# EAGLE design obdlogger_v0.2 (EAGLE 8.6.0)
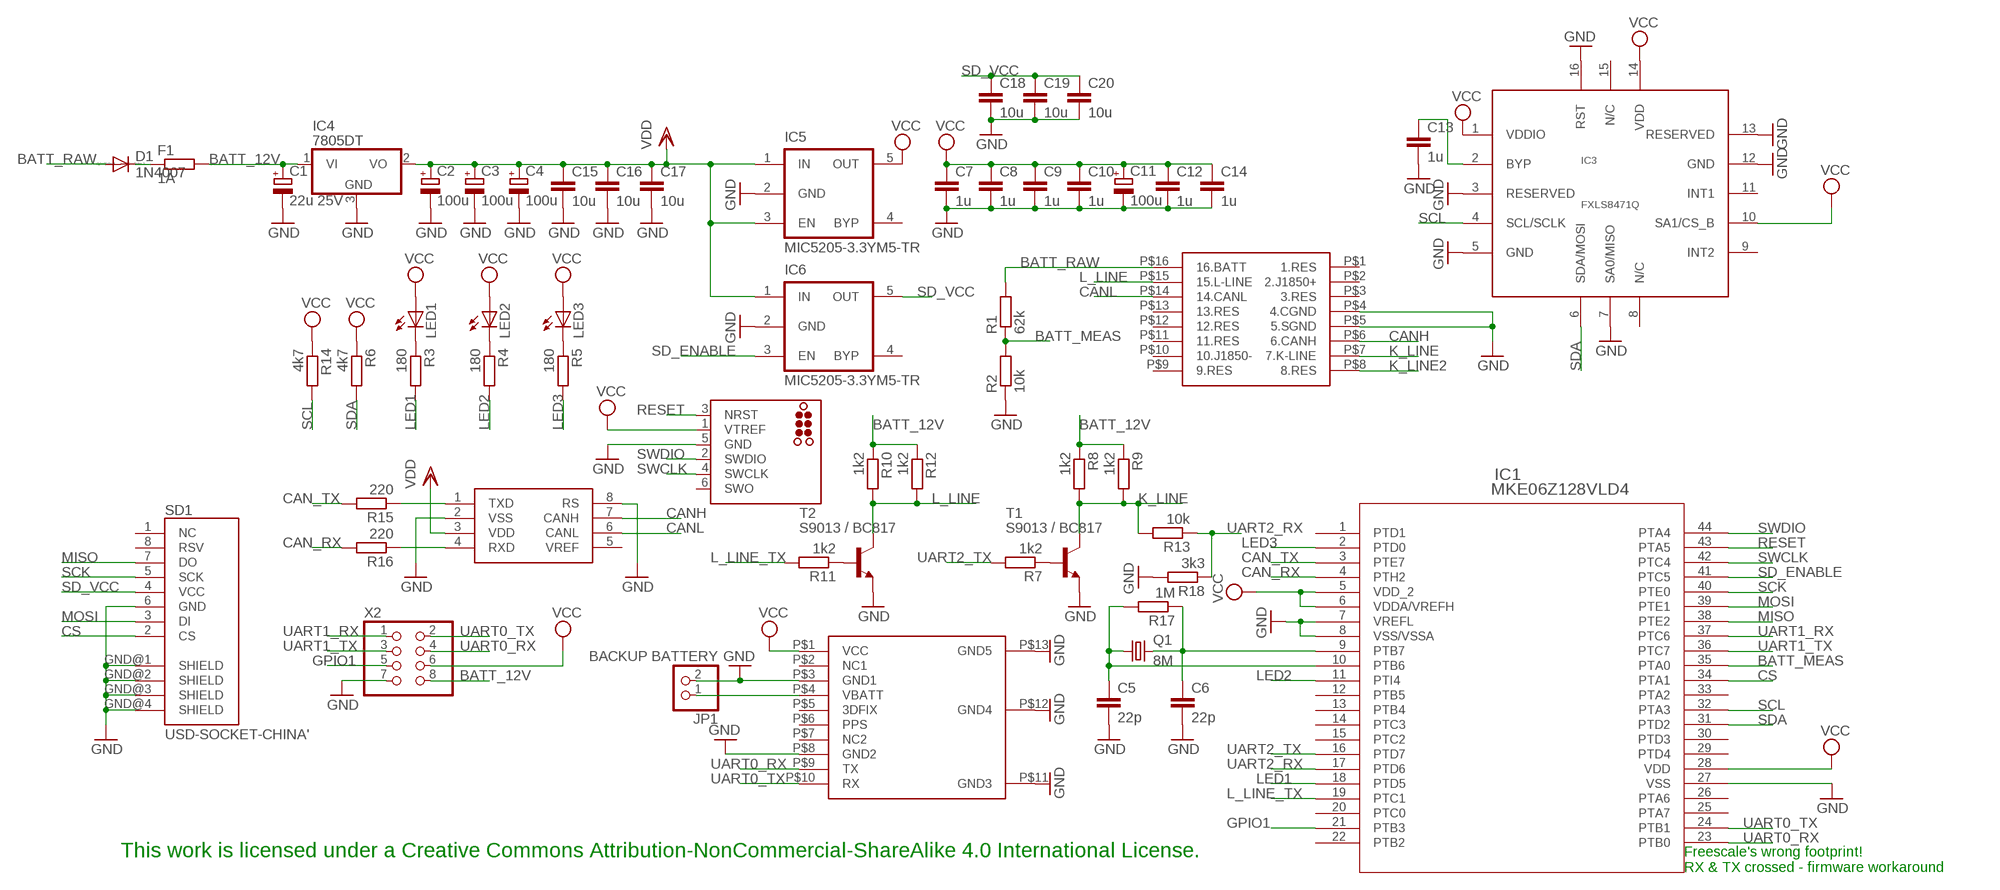
[diagram p0: schematic, sheet 1]

## Parts
C1  22u 25V  CPOL-EUSMCC  [SMC_C]
C2  100u  CPOL-EUSMCB  [SMC_B]
C3  100u  CPOL-EUSMCB  [SMC_B]
C4  100u  CPOL-EUSMCB  [SMC_B]
C5  22p  C-EUC0603K  [C0603K]
C6  22p  C-EUC0603K  [C0603K]
C7  1u  C-EUC0603K  [C0603K]
C8  1u  C-EUC0603K  [C0603K]
C9  1u  C-EUC0603K  [C0603K]
C10  1u  C-EUC0603K  [C0603K]
C11  100u  CPOL-EUSMCB  [SMC_B]
C12  1u  C-EUC0603K  [C0603K]
C13  1u  C-EUC0603K  [C0603K]
C14  1u  C-EUC0603K  [C0603K]
C15  10u  C-EUC0603K  [C0603K]
C16  10u  C-EUC0603K  [C0603K]
C17  10u  C-EUC0603K  [C0603K]
C18  10u  C-EUC0603K  [C0603K]
C19  10u  C-EUC0603K  [C0603K]
C20  10u  C-EUC0603K  [C0603K]
D1  1N4007  DIODE-C1702-05  [C1702-05]
F1  1A  R-EU_R1206  [R1206]
IC1  MKE06Z128VLD4  [LQFP-44_10X10X1.4]
IC2  MCP2561  MCP2551  [SO08]
IC3  FXLS8471Q  [16QFN-5/3]
IC4  7805DT  [TO252]
IC5  MIC5205-3.3YM5-TR  MIC5205  [SOT-23-5]
IC6  MIC5205-3.3YM5-TR  MIC5205  [SOT-23-5]
JP1  BACKUP BATTERY  PINHD-1X2  [1X02]
LED1  LED3MM  [LED3MM]
LED2  LED3MM  [LED3MM]
LED3  LED3MM  [LED3MM]
Q1  8M  CRYSTALHC49UP  [HC49UP]
R1  62k  R-EU_R0603  [R0603]
R2  10k  R-EU_R0603  [R0603]
R3  180  R-EU_R0603  [R0603]
R4  180  R-EU_R0603  [R0603]
R5  180  R-EU_R0603  [R0603]
R6  4k7  R-EU_R0603  [R0603]
R7  1k2  R-EU_R0603  [R0603]
R8  1k2  R-EU_M1206  [M1206]
R9  1k2  R-EU_M1206  [M1206]
R10  1k2  R-EU_M1206  [M1206]
R11  1k2  R-EU_R0603  [R0603]
R12  1k2  R-EU_M1206  [M1206]
R13  10k  R-EU_R0603  [R0603]
R14  4k7  R-EU_R0603  [R0603]
R15  220  R-EU_R0603  [R0603]
R16  220  R-EU_R0603  [R0603]
R17  1M  R-EU_R0603  [R0603]
R18  3k3  R-EU_R0603  [R0603]
SD1  USD-SOCKET-CHINA'  [USD-SOCKET-PP]
T1  S9013 / BC817  BC817-16-NPN-SOT23-BEC  [SOT23-BEC]
T2  S9013 / BC817  BC817-16-NPN-SOT23-BEC  [SOT23-BEC]
U$2  SWD-NEEDLE  [TC2030-MCP]
U$4  PA6C  [PA6C]
X1  OBD2-RIGHT-ANGLEPROPER  [OBD2-RIGHT-ANGLE-PCB-PROPER]
X2  PINHD-2X4  [2X04]

## Nets
BATT_12V: C1.+ F1.2 IC4.1(VI) R8.1 R9.1 R10.1 R12.1 X2.8
BATT_MEAS: IC1.35(PTA0) R1.1 R2.2
BATT_RAW: D1.A R1.2 X1.P$16(16.BATT)
CAN_RX: IC1.4(PTH2) R16.2
CAN_TX: IC1.3(PTE7) R15.2
CANH: IC2.7(CANH) X1.P$6(6.CANH)
CANL: IC2.6(CANL) X1.P$14(14.CANL)
CS: IC1.34(PTA1) SD1.2(CS)
GND: C1.- C2.- C3.- C4.- C5.2 C6.2 C7.2 C8.2 C9.2 C10.2 C11.- C12.2 C13.2 C14.2 C15.2 C16.2 C17.2 C18.2 C19.2 C20.2 IC1.7(VREFL) IC1.8(VSS/VSSA) IC1.27(VSS) IC2.2(VSS) IC2.8(RS) IC3.3(RESERVED) IC3.5(GND) IC3.7(SA0/MISO) IC3.12(GND) IC3.13(RESERVED) IC3.16(RST) IC4.3(GND) IC5.2(GND) IC6.2(GND) JP1.2 R2.1 R18.2 SD1.6(GND) SD1.GND@1(SHIELD) SD1.GND@2(SHIELD) SD1.GND@3(SHIELD) SD1.GND@4(SHIELD) T1.E T2.E U$2.5(GND) U$4.P$3(GND1) U$4.P$8(GND2) U$4.P$11(GND3) U$4.P$12(GND4) U$4.P$13(GND5) X1.P$4(4.CGND) X1.P$5(5.SGND) X2.7
GPIO1: IC1.21(PTB3) X2.5
K_LINE: R8.2 R9.2 R13.2 T1.C X1.P$7(7.K-LINE)
K_LINE2: X1.P$8(8.RES)
L_LINE: R10.2 R12.2 T2.C X1.P$15(15.L-LINE)
L_LINE_TX: IC1.19(PTC1) R11.2
LED1: IC1.18(PTD5) R3.2
LED2: IC1.11(PTI4) R4.2
LED3: IC1.2(PTD0) R5.2
MISO: IC1.38(PTE2) SD1.7(DO)
MOSI: IC1.39(PTE1) SD1.3(DI)
N$1: LED1.K(C) R3.1
N$2: JP1.1 U$4.P$4(VBATT)
N$3: R7.1 T1.B
N$4: LED2.K(C) R4.1
N$5: LED3.K(C) R5.1
N$6: C6.1 IC1.9(PTB7) Q1.2 R17.1
N$7: C5.1 IC1.10(PTB6) Q1.1 R17.2
N$8: C13.1 IC3.2(BYP)
N$9: IC2.1(TXD) R15.1
N$10: IC2.4(RXD) R16.1
N$11: D1.C F1.1
N$12: R11.1 T2.B
RESET: IC1.43(PTA5) U$2.3(NRST)
SCK: IC1.40(PTE0) SD1.5(SCK)
SCL: IC1.32(PTA3) IC3.4(SCL/SCLK) R14.2
SD_ENABLE: IC1.41(PTC5) IC6.3(EN)
SD_VCC: C18.1 C19.1 C20.1 IC6.5(OUT) SD1.4(VCC)
SDA: IC1.31(PTD2) IC3.6(SDA/MOSI) R6.2
SWCLK: IC1.42(PTC4) U$2.4(SWCLK)
SWDIO: IC1.44(PTA4) U$2.2(SWDIO)
UART0_RX: IC1.23(PTB0) U$4.P$9(TX) X2.4
UART0_TX: IC1.24(PTB1) U$4.P$10(RX) X2.2
UART1_RX: IC1.37(PTC6) X2.1
UART1_TX: IC1.36(PTC7) X2.3
UART2_RX: IC1.17(PTD6) R13.1 R18.1
UART2_TX: IC1.16(PTD7) R7.2
VCC: C7.1 C8.1 C9.1 C10.1 C11.+ C12.1 C14.1 IC1.5(VDD_2) IC1.6(VDDA/VREFH) IC1.28(VDD) IC3.1(VDDIO) IC3.10(SA1/CS_B) IC3.14(VDD) IC5.5(OUT) LED1.A LED2.A LED3.A R6.1 R14.1 U$2.1(VTREF) U$4.P$1(VCC) X2.6
VCC_5V: C2.+ C3.+ C4.+ C15.1 C16.1 C17.1 IC2.3(VDD) IC4.2(VO) IC5.1(IN) IC5.3(EN) IC6.1(IN) ; supply symbol labelled VDD
Unconnected: IC1.1(PTD1) IC1.12(PTB5) IC1.13(PTB4) IC1.14(PTC3) IC1.15(PTC2) IC1.20(PTC0) IC1.22(PTB2) IC1.25(PTA7) IC1.26(PTA6) IC1.29(PTD4) IC1.30(PTD3) IC1.33(PTA2) IC2.5(VREF) IC3.8(N/C) IC3.9(INT2) IC3.11(INT1) IC3.15(N/C) IC5.4(BYP) IC6.4(BYP) SD1.1(NC) SD1.8(RSV) U$2.6(SWO) U$4.P$2(NC1) U$4.P$5(3DFIX) U$4.P$6(PPS) U$4.P$7(NC2) X1.P$1(1.RES) X1.P$2(2.J1850+) X1.P$3(3.RES) X1.P$9(9.RES) X1.P$10(10.J1850-) X1.P$11(11.RES) X1.P$12(12.RES) X1.P$13(13.RES)

## Notes on the sheet
- This work is licensed under a Creative Commons Attribution-NonCommercial-ShareAlike 4.0 International License.
- Freescale's wrong footprint!
  RX & TX crossed - firmware workaround

## Library data of the parts
C1-C4 C11 = rcl:CPOL-EU: POLARIZED CAPACITOR, European symbol; SPICEPREFIX: C
C5-C10 C12-C20 = rcl:C-EU: CAPACITOR, European symbol; SPICEPREFIX: C
D1 = diode:DIODE-: DIODE
F1 = resistor:R-EU_: RESISTOR, European symbol
IC1 = obd-connector:MKE06Z128VLD4; CPU: ARM Cortex-M0+; FLASHKB: 128; MANUFACTURER_PART_NUMBER: mke06z128vld4; MAXFREQUENCY: 48; PINCOUNT: 44; SRAMKB: 16; VENDOR: FREESCALE
IC2 = SparkFun:MCP2551
IC3 = BaseApp:FXLS8471Q: Digikey No :- __FXLS8471QR1CT-ND__
IC4 = linear:78*: Positive VOLTAGE REGULATOR Source: http://cache.national.com/ds/LM/LM78L05.pdf http://www.fairchildsemi.com/ds/LM/LM7805.pdf
IC5 IC6 = dp_devices:MIC5205: 150ma Low-Noise LDO Regulator
JP1 = pinhead:PINHD-1X2: PIN HEADER
LED1-LED3 = led:LED: LED OSRAM: - CHIPLED LG R971, LG N971, LY N971, LG Q971, LY Q971, LO R971, LY R971 LH N974, LH R974 LS Q976, LO Q976, LY Q976 LO Q996 - Hyper CHIPLED LW Q18S LB Q993, LB Q99A, LB R99A - SideLED LS A670, LO A670, LY A670, LG A670, LP A670 LB A673, LV A673, LT A673, LW A673 LH A674 LY A675 LS A676, LA A676, LO A676, LY A676, LW A676 LS A679, LY A679, LG A679 - Hyper Micro SIDELED® LS Y876, LA Y876, LO Y876, LY Y876 LT Y87S - SmartLED LW L88C, LW L88S LB L89C, LB L89S, LG L890 LS L89K, LO L89K, LY L89K LS L896, LA L896, LO L896, LY L896 - TOPLED LS T670, LO T670, LY T670, LG T670, LP T670 LSG T670, LSP T670, LSY T670, LOP T670, LYG T670 LG T671, LOG T671, LSG T671 LB T673, LV T673, LT T673, LW T673 LH T674 LS T676, LA T676, LO T676, LY T676, LB T676, LH T676, LSB T676, LW T676 LB T67C, LV T67C, LT T67C, LS T67K, LO T67K, LY T67K, LW E67C LS E67B, LA E67B, LO E67B, LY E67B, LB E67C, LV E67C, LT E67C LW T67C LS T679, LY T679, LG T679 LS T770, LO T770, LY T770, LG T770, LP T770 LB T773, LV T773, LT T773, LW T773 LH T774 LS E675, LA E675, LY E675, LS T675 LS T776, LA T776, LO T776, LY T776, LB T776 LHGB T686 LT T68C, LB T68C - Hyper Mini TOPLED® LB M676 - Mini TOPLED Santana® LG M470 LS M47K, LO M47K, LY M47K Source: http://www.osram.convergy.de LUXEON: - LUMILED® LXK2-PW12-R00, LXK2-PW12-S00, LXK2-PW14-U00, LXK2-PW14-V00 LXK2-PM12-R00, LXK2-PM12-S00, LXK2-PM14-U00 LXK2-PE12-Q00, LXK2-PE12-R00, LXK2-PE12-S00, LXK2-PE14-T00, LXK2-PE14-U00 LXK2-PB12-K00, LXK2-PB12-L00, LXK2-PB12-M00, LXK2-PB14-N00, LXK2-PB14-P00, LXK2-PB14-Q00 LXK2-PR12-L00, LXK2-PR12-M00, LXK2-PR14-Q00, LXK2-PR14-R00 LXK2-PD12-Q00, LXK2-PD12-R00, LXK2-PD12-S00 LXK2-PH12-R00, LXK2-PH12-S00 LXK2-PL12-P00, LXK2-PL12-Q00, LXK2-PL12-R00 Source: www.luxeon.com KINGBRIGHT: KA-3528ASYC Source: www.kingbright.com
Q1 = crystal:CRYSTAL: CRYSTAL; OC_FARNELL: unknown; OC_NEWARK: unknown
R1-R18 = rcl:R-EU_: RESISTOR, European symbol; SPICEPREFIX: R
SD1 = BaseApp:USD-SOCKET-CHINA
T1 T2 = transistor:*-NPN-: NPN Transistror BF959 corrected 2008.03.06
U$2 = tag-connect:SWD-NEEDLE
U$4 = filo_GlobalTop_GPS:PA6C
X1 = obd-connector:OBD2-RIGHT-ANGLE
X2 = pinhead:PINHD-2X4: PIN HEADER

## Board
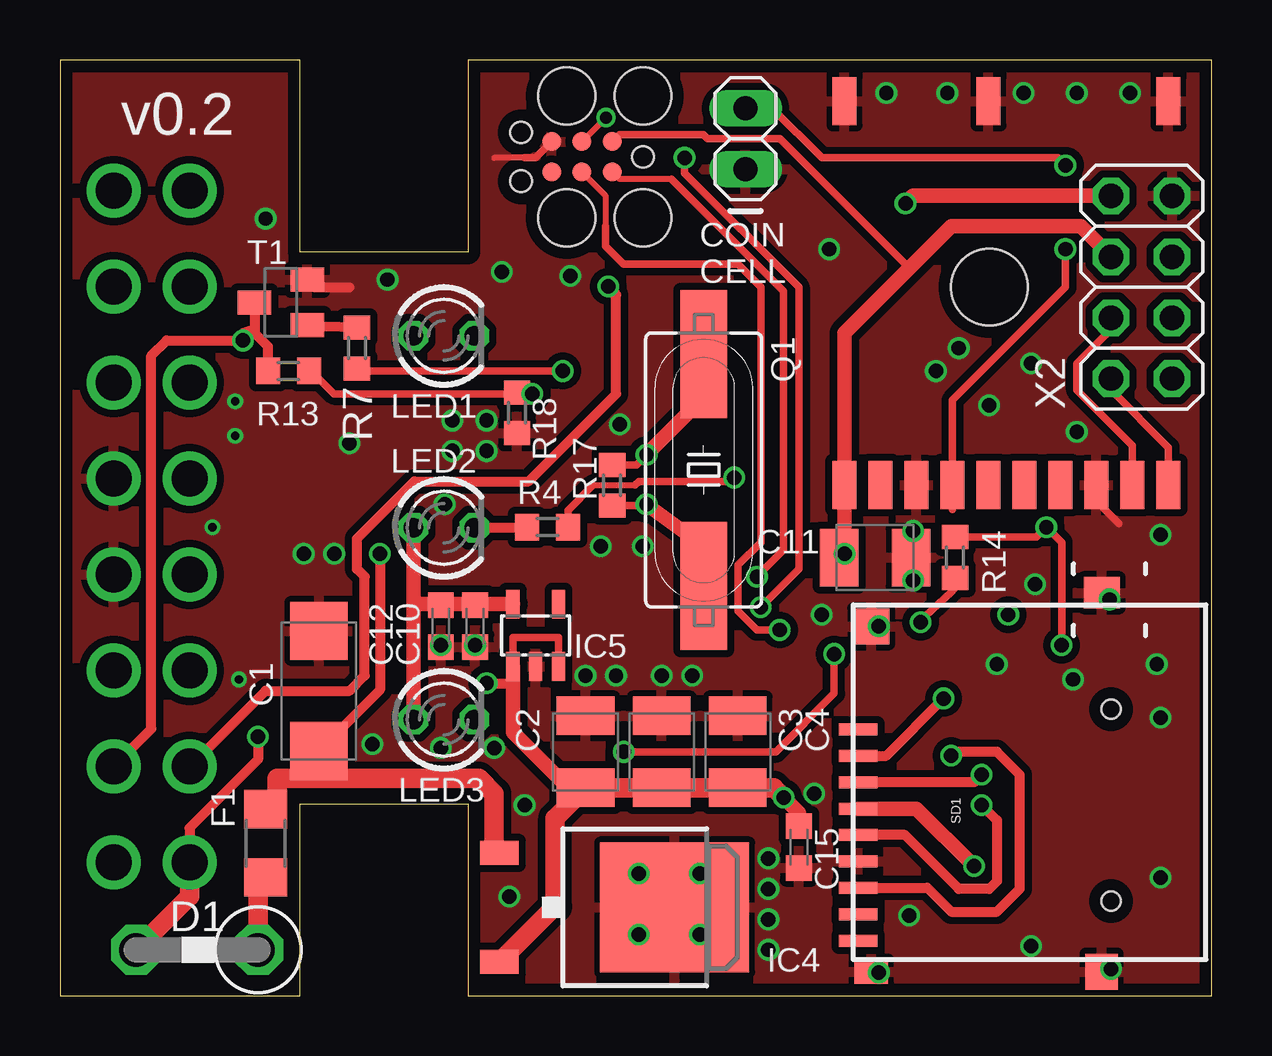
[diagram p1: board, top side]
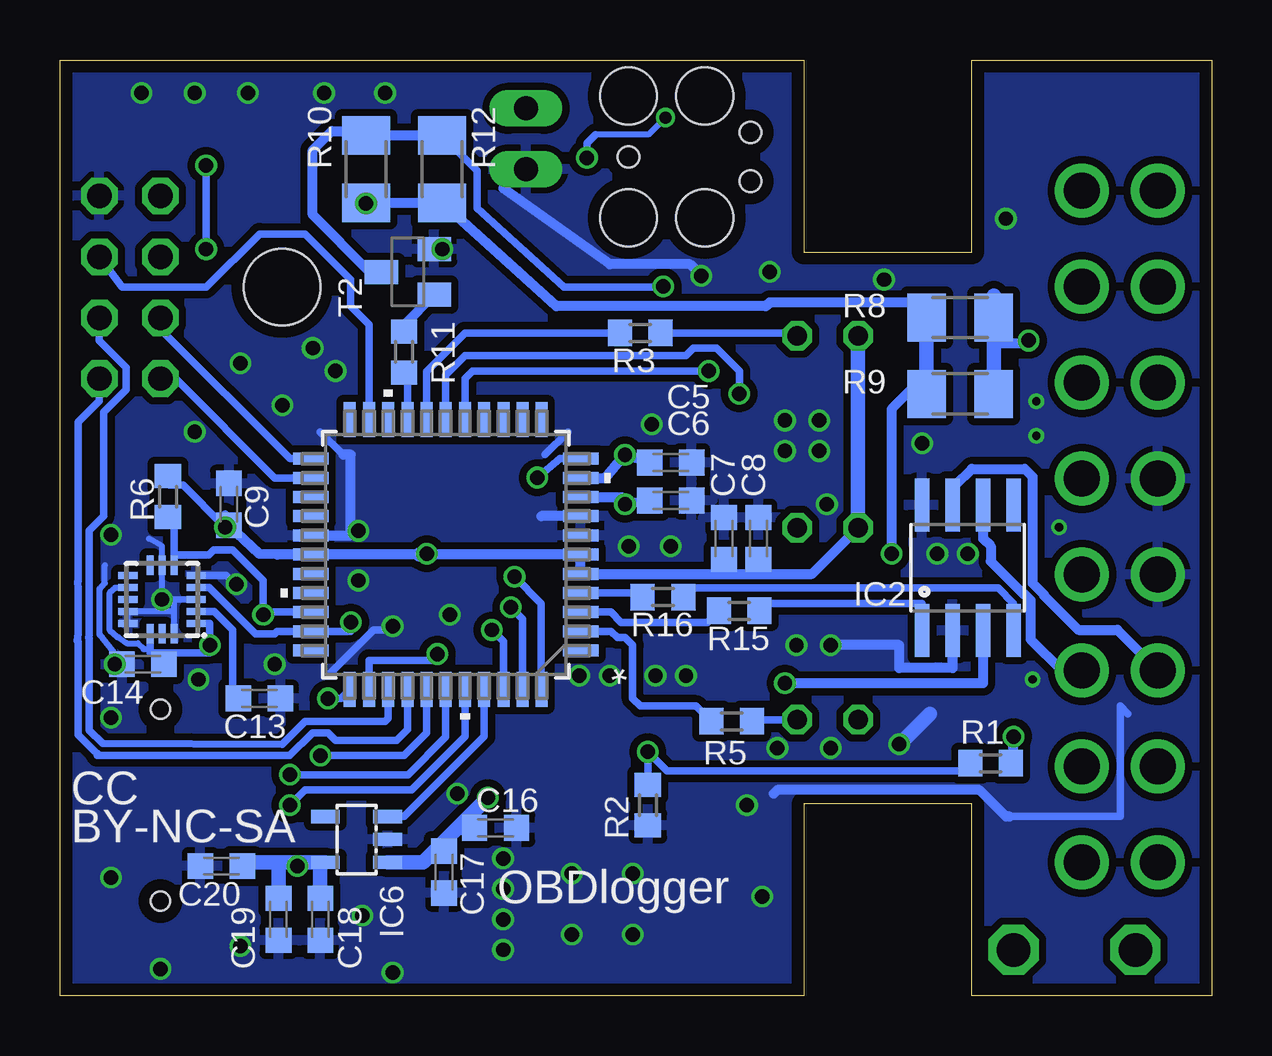
[diagram p2: board, bottom side, seen from below]

Size 48 x 39 mm. Coordinates in mm from the lower left corner, seen from the top.
Outline: 0,0 10,0 10,8 17,8 17,0 48,0 48,39 17,39 17,31 10,31 10,39 0,39 0,0
Copper layers (1*16): Top 0.035mm / dielectric 1.6mm / Bottom 0.035mm
Design rules "Elecrow_2-layer_PCB_eagle_rule": minimum track width 6mil, minimum drill 12mil, track to track 6mil, track to pad 8mil, pad to pad 12mil, via to via 12mil, smd to smd 0mil, copper to edge 20mil, drill to drill 10mil, minimum pad ring 6mil, minimum via ring 6mil, stop-mask expansion 0mil, vias tented up to drill 100mil, thermal gap 10mil
Holes 3.2 mm at 38.73,29.53

### Footprints (pad centres in the part's own frame; a part is rotated, then mirrored left to right if it is on the bottom)
SMC_C = smd 2.4 x 2.4: + -2.5,0; - 2.5,0
SMC_B = smd 1.6 x 2.4: + -1.5,0; - 1.5,0
C0603K = smd 1.05 x 1.08: 1 -0.875,0; 2 0.875,0
C1702-05 = drill 1.397 octagon: A 2.54,0; C -2.54,0
R1206 = smd 1.6 x 1.803: 1 -1.422,0; 2 1.422,0
LQFP-44_10X10X1.4 = smd 1.461 x 0.501: 1 -5.625,4; 2 -5.625,3.2; 3 -5.625,2.4; 4 -5.625,1.6; 5 -5.625,0.8; 6 -5.625,0; 7 -5.625,-0.8; 8 -5.625,-1.6; 9 -5.625,-2.4; 10 -5.625,-3.2; 11 -5.625,-4; 23 5.625,-4; 24 5.625,-3.2; 25 5.625,-2.4; 26 5.625,-1.6; 27 5.625,-0.8; 28 5.625,0; 29 5.625,0.8; 30 5.625,1.6; 31 5.625,2.4; 32 5.625,3.2; 33 5.625,4 | smd 0.501 x 1.461: 12 -4,-5.625; 13 -3.2,-5.625; 14 -2.4,-5.625; 15 -1.6,-5.625; 16 -0.8,-5.625; 17 0,-5.625; 18 0.8,-5.625; 19 1.6,-5.625; 20 2.4,-5.625; 21 3.2,-5.625; 22 4,-5.625; 34 4,5.625; 35 3.2,5.625; 36 2.4,5.625; 37 1.6,5.625; 38 0.8,5.625; 39 0,5.625; 40 -0.8,5.625; 41 -1.6,5.625; 42 -2.4,5.625; 43 -3.2,5.625; 44 -4,5.625
SO08 = smd 0.61 x 2.21: 1 -1.905,-2.616; 2 -0.635,-2.616; 3 0.635,-2.616; 4 1.905,-2.616; 5 1.905,2.616; 6 0.635,2.616; 7 -0.635,2.616; 8 -1.905,2.616
16QFN-5/3 = smd 0.8 x 0.3: 1 -1.425,1; 2 -1.425,0.5; 3 -1.425,0; 4 -1.425,-0.5; 5 -1.425,-1; 9 1.425,-1; 10 1.425,-0.5; 11 1.425,0; 12 1.425,0.5; 13 1.425,1 | smd 0.3 x 0.8: 6 -0.5,-1.425; 7 0,-1.425; 8 0.5,-1.425; 14 0.5,1.425; 15 0,1.425; 16 -0.5,1.425
TO252 = smd 1 x 1.6: 1 -2.28,-4.8; 2 2.28,-4.8 | smd 5.4 x 6.2: 3 0,2.5
SOT-23-5 = smd 0.55 x 1.2: 1 -0.95,-1.3; 2 0,-1.3; 3 0.95,-1.3; 4 0.95,1.3; 5 -0.95,1.3
1X02 = drill 1.016 long: 1 -1.27,0; 2 1.27,0
LED3MM = drill 0.813 octagon: A -1.27,0; K 1.27,0
HC49UP = smd 5.334 x 1.93: 1 -4.826,0; 2 4.826,0
R0603 = smd 1 x 1.1: 1 -0.85,0; 2 0.85,0
M1206 = smd 1.6 x 2: 1 -1.4,0; 2 1.4,0
USD-SOCKET-PP = smd 0.5 x 1.6: 1 2.2,-1.2; 2 1.1,-1.2; 3 0,-1.2; 4 -1.1,-1.2; 5 -2.2,-1.2; 6 -3.3,-1.2; 7 -4.4,-1.2; 8 -5.5,-1.2; CD1 -6.6,-1.2 | smd 1.5 x 1.35: GND@1 -7.9,-11.35 | smd 1.3 x 1.5: GND@2 7.9,-11.35 | smd 1.5 x 1.5: GND@3 6.5,-1.75 | smd 1 x 1.4: GND@4 -7.9,-1.75 | hole 0.8: -4.95,-11.75; 3.05,-11.75
SOT23-BEC = smd 1 x 1.4: B -0.95,-1.1; C 0,1.1; E 0.95,-1.1
TC2030-MCP = smd 0.787 x 0.787: 1 1.27,-0.635; 2 1.27,0.635; 3 2.54,-0.635; 4 2.54,0.635; 5 3.81,-0.635; 6 3.81,0.635 | hole 0.889: 0,0; 5.08,-1.016; 5.08,1.016 | hole 2.375: 0,2.54; 0,-2.54; 3.175,-2.54; 3.175,2.54
PA6C = smd 2 x 1: P$1 0,0; P$2 0,-1.5; P$3 0,-3; P$4 0,-4.5; P$5 0,-6; P$6 0,-7.5; P$7 0,-9; P$8 0,-10.5; P$9 0,-12; P$10 0,-13.5; P$11 16,-13.5; P$12 16,-6; P$13 16,0
OBD2-RIGHT-ANGLE-PCB-PROPER = drill 1.5: P$1 3.16,-14; P$2 3.16,-10; P$3 3.16,-6; P$4 3.16,-2; P$5 3.16,2; P$6 3.16,6; P$7 3.16,10; P$8 3.16,14; P$9 0,-14; P$10 0,-10; P$11 0,-6; P$12 0,-2; P$13 0,2; P$14 0,6; P$15 0,10; P$16 0,14
2X04 = drill 1.016 octagon: 1 -3.81,-1.27; 2 -3.81,1.27; 3 -1.27,-1.27; 4 -1.27,1.27; 5 1.27,-1.27; 6 1.27,1.27; 7 3.81,-1.27; 8 3.81,1.27

### Placement (x,y rotation side)
C1  10.79,12.7 90 top
C2  21.91,10.16 90 top
C3  25.08,10.16 90 top
C4  28.26,10.16 90 top
C5  22.54,22.23 0 bottom
C6  22.54,20.64 0 bottom
C7  20.32,19.05 90 bottom
C8  18.89,19.05 90 bottom
C9  40.96,20.48 90 bottom
C10  17.3,15.4 270 top
C11  33.97,18.26 0 top
C12  15.88,15.4 270 top
C13  39.69,12.38 0 bottom
C14  44.54,13.81 180 bottom
C15  30.8,6.19 270 top
C16  29.84,6.99 0 bottom
C17  31.98,5.15 270 bottom
C18  37.15,3.17 270 bottom
C19  38.89,3.17 270 bottom
C20  41.27,5.4 180 bottom
D1  5.71,1.91 180 top
F1  8.57,6.35 90 top
IC1  31.92,18.38 180 bottom
IC2  10.16,17.83 0 bottom
IC3  43.75,16.51 180 bottom
IC4  23.12,3.68 270 top
IC5  19.82,15.02 0 top
IC6  35.64,6.5 90 bottom
JP1  28.57,35.72 270 top
LED1  16,27.5 0 top
LED2  16,19.5 0 top
LED3  16,11.5 0 top
Q1  26.83,21.91 270 top
R1  9.21,9.68 0 bottom
R2  23.5,7.94 90 bottom
R3  23.81,27.62 180 bottom
R4  20.32,19.53 0 top
R5  20,11.43 180 bottom
R6  43.5,20.8 270 bottom
R7  12.38,26.99 270 top
R8  10.48,28.26 0 bottom
R9  10.48,25.08 0 bottom
R10  35.24,34.45 90 bottom
R11  33.66,26.83 270 bottom
R12  32.07,34.45 90 bottom
R13  9.53,26.04 180 top
R14  37.31,18.26 270 top
R15  19.68,16.03 180 bottom
R16  22.86,16.61 180 bottom
R17  23.02,21.27 90 top
R18  19.05,24.29 270 top
SD1  32.07,8.89 90 top
T1  9.21,28.89 90 top
T2  33.5,30.16 90 bottom
U$2  24.3,34.96 180 top
U$4  32.7,21.27 90 top
X1  5.4,19.55 180 top
X2  45.09,29.53 90 top

### Tracks (layer width: path | path; a pad name or v marks a point on that pad's centre or on a via)
BATT_12V  (via drill 0.6)
  Top 0.305: 9.21,8.73 9.37,9.05
  Top 0.406: 10.79,9.05 C1.+ 13.34,12.74 v13.34,18.41 | F1.2 9.05,7.77 9.05,8.1
  Top 0.61: v35.24,33.02 35.56,33.34 X2.8
  Top 0.813: 9.05,8.1 9.05,9.05 9.37,9.05 10.79,9.05 17.46,9.05 18.1,8.41 18.1,6.02 IC4.1
  Bottom 0.305: R10.1 35.27,33.02 v35.24,33.02
  Bottom 0.406: R9.1 12.38,25.4 13.34,24.45 v13.34,18.41 | 12.06,28.57 R8.1 12.2,28.89 18.41,28.89 18.57,28.73 27.3,28.73 29.08,30.35 R12.1 R10.1
  Bottom 0.61: R8.1 R9.1
BATT_MEAS  (via drill 0.6)
  Top 0.305: v23.5,10.16 29.84,10.16 32.27,12.59 v32.27,14.24
  Bottom 0.305: R1.1 10.06,9.37 22.7,9.37 v23.5,10.16 R2.2 | IC1.35 35.12,13.97 32.54,13.97 v32.27,14.24
BATT_RAW  (via drill 0.6)
  Top 0.406: v8.26,10.79 8.26,9.84 5.4,6.99 X1.P$16
  Top 0.813: D1.A 5.4,4.13 X1.P$16
  Bottom 0.406: R1.2 8.26,9.79 v8.26,10.79
CAN_RX
  Bottom 0.305: IC1.4 23.82,16.78 R16.2
CAN_TX
  Bottom 0.305: IC1.3 25.03,15.98 24.61,15.56 21.01,15.56 R15.2
CANH
  Bottom 0.406: IC2.7 10.79,21.27 10.68,21.27 10,21.95 7.78,21.95 7.46,21.63 7.46,17.19 6.99,16.72 6.99,16.67 5.56,15.24 3.92,15.24 X1.P$6
CANL
  Bottom 0.406: IC2.6 9.53,19.05 9.21,18.73 9.21,18.1 7.83,16.72 7.78,16.72 7.54,16.48 7.54,14.85 6.25,13.55 X1.P$14
CS  (via drill 0.6)
  Top 0.406: SD1.2 34.44,9.99 v36.83,12.38
  Bottom 0.305: IC1.34 36.29,12.38 v36.83,12.38
GND  (via drill 0.35, 0.6)
  Top 0.254: 19.37,34.92 18.1,34.92 | SD1.GND@2 43.74,16.55 v43.74,16.51
  Top 0.305: U$2.5 19.82,34.92 19.37,34.92 | U$4.P$8 43.2,20.61 44.13,19.68
  Top 0.406: IC4.3 25.46,2.54 v26.67,2.54 | T1.E 10.62,29.53 12.06,29.53
  Bottom 0.254: IC3.16 43.24,16.01 | 43.24,16.01 IC3.12 IC3.13 | 43.24,16.01 43.24,16.51 IC3.3 v43.74,16.51 IC3.7 43.74,18.73 44.29,19.05 | C14.2 45.64,14.16 46.35,15.05 46.35,16.95 46.13,17.2 46.13,17.94
  Bottom 0.305: 3.49,11.75 3.81,12.06 3.81,7.46 8.41,7.46 | 36.2,22.54 37.15,23.5 | 27.78,22.54 26.83,23.5 | 36.83,13.34 34.92,15.24 34.29,15.24 | IC3.5 41.07,17.51 v40.64,17.14
  Bottom 0.406: IC2.2 10.79,13.65 13.02,13.65 13.02,14.61 v15.88,14.61 | IC1.27 35.88,19.18 35.88,22.54 36.2,22.54 | IC1.8 27.94,19.98 | 8.41,7.46 8.57,7.46 9.68,8.57 18.1,8.57 18.26,8.41 | v21.27,30 21.75,30.48 25.08,30.48 29.53,33.66
  Bottom 0.61: v13.02,10.48 11.75,11.75
  other vias: 21.91,13.34 23.18,13.34 25.08,13.34 24.13,5.08 26.67,5.08 24.13,2.54 29.53,1.91 29.53,3.17 29.53,4.45 29.53,5.71 11.43,18.41 10.16,18.41 12.06,23.02 17.3,14.61 24.29,18.73 18.73,4.13 19.37,7.94 18.1,10.32 23.34,23.81 35.56,19.37 17.78,23.97 17.78,22.7 16.35,22.7 16.35,23.97 35.56,17.3 31.75,15.88 15.88,10.32 34.45,37.62 40.48,26.35 38.73,24.61 39.05,13.81 45.72,13.81 22.54,18.73 16.03,20.48 42.39,23.5 34.13,15.4 26.35,13.34 36.99,37.62 40.16,37.62 42.39,37.62 44.61,37.62 45.88,4.92 40.48,2.06 8.57,32.38 13.65,29.84 18.41,30.16 37.47,26.99 36.51,26.04 32.07,31.11 31.43,8.41 35.4,3.33 34.13,0.95 43.81,1.11 45.88,19.21 42.23,13.18 45.88,11.59 7.3,24.77 7.3,23.34 6.35,19.53 7.46,13.18
  pour Bottom (isolate 0.305): 0,39.05 48.9,39.05 48.9,0 0,0
  pour Top (isolate 0.305): 0,39.05 48.9,39.05 48.9,0 0,0
GPIO1
  Bottom 0.305: IC1.21 35.12,27.97 35.88,28.73 35.88,29.84 37.78,31.75 39.69,31.75 41.91,29.53 45.4,29.53 X2.5
K_LINE  (via drill 0.6)
  Top 0.406: T1.C 8.11,27.78 | 8.11,27.78 8.11,27.62 8.68,27.05 R13.2 | 8.11,27.78 7.62,27.61 v7.62,27.3 4.45,27.3 3.81,26.67 3.81,11.12 X1.P$7
  Top 0.61: 8.26,29.04 T1.C
  Bottom 0.406: 9.08,27.19 7.67,27.19 v7.62,27.3
  Bottom 0.61: R9.2 9.08,27.19 R8.2 9.08,29.18
L_LINE  (via drill 0.6)
  Top 0.406: X1.P$15 5.42,9.55 8.57,12.7 12.06,12.7 12.7,13.34 12.7,17.46 12.38,17.78 12.38,19.05 14.76,21.43 19.53,21.43 23.18,25.08 23.18,29.21 v22.86,29.57
  Bottom 0.305: v22.86,29.57 22.86,29.53 26.99,29.53 30.61,32.83 30.61,34.39 R12.2
  Bottom 0.406: R12.2 R10.2 35.43,36.04 36.67,36.04 37.47,35.24 37.47,32.54 35.08,30.16 T2.C
L_LINE_TX
  Bottom 0.305: IC1.19 33.52,26.11 R11.2
LED1
  Bottom 0.305: R3.2 31.11,27.62 32.72,26.02 IC1.18
LED2  (via drill 0.6)
  Top 0.254: 22.23,21.27 23.97,21.27
  Top 0.305: R4.2 21.17,20.22 22.23,21.27 | 23.97,21.27 24.13,21.43 27.94,21.43 v28.1,21.59
  Bottom 0.305: v28.1,21.59 27.15,22.38 IC1.11
LED3
  Bottom 0.305: R5.2 21.49,12.06 23.81,12.06 24.13,12.38 24.13,14.61 24.45,14.92 24.77,14.92 25.02,15.18 IC1.2
MISO  (via drill 0.6)
  Top 0.406: SD1.7 36.15,4.49 37.15,3.49 39.05,3.49 40.01,4.45 40.01,9.21 39.05,10.16 37.31,10.16 v37.15,10
  Bottom 0.305: IC1.38 32.72,10.94 33.66,10 v37.15,10
MOSI  (via drill 0.6)
  Top 0.406: v38.42,9.21 38.1,8.89 SD1.3
  Bottom 0.305: IC1.39 31.92,10.79 33.5,9.21 v38.42,9.21
N$1
  Bottom 0.305: R3.1 17.39,27.62 LED1.K
N$2  (via drill 0.6)
  Top 0.305: 37.2,20.27 U$4.P$4 37.2,24.82 41.91,29.53 v41.91,31.11 | JP1.1 29.69,36.99 31.75,34.92 41.59,34.92 v41.91,34.61
  Bottom 0.305: v41.91,34.61 v41.91,31.11
N$3
  Top 0.406: R7.1 10.26,27.9 T1.B
N$4
  Top 0.406: R4.1 19.44,19.5 LED2.K
N$5
  Bottom 0.305: R5.1 19.08,11.5 LED3.K
N$6  (via drill 0.6)
  Top 0.305: R17.1 24.39,20.42 v24.45,20.48
  Top 0.61: v24.45,20.48 26.83,18.73 Q1.2
  Bottom 0.406: IC1.9 24.59,20.78 v24.45,20.48 C6.1
N$7  (via drill 0.6)
  Top 0.305: R17.2 24.03,22.12 v24.45,22.54
  Top 0.61: v24.45,22.54 26.83,24.92 Q1.1
  Bottom 0.406: IC1.10 25.25,21.58 v24.45,22.54 C5.1
N$8
  Bottom 0.305: IC3.2 41.57,16.01 40.8,15.24 40.8,12.62 C13.1 40.56,12.62
N$9
  Bottom 0.305: R15.1 18.52,16.35 12.06,16.35 IC2.1
N$10
  Bottom 0.305: R16.1 21.69,16.99 8.89,16.99 8.26,16.35 IC2.4
N$11
  Top 0.813: F1.1 8.26,4.93 D1.C
N$12
  Bottom 0.406: R11.1 33.66,27.95 T2.B
RESET  (via drill 0.5, 0.6)
  Top 0.254: U$2.3 v22.76,36.59 v22.76,36.6
  Top 0.305: v26.04,34.92 26.04,34.29 30.8,29.53 30.8,17.78 v29.21,16.19
  Bottom 0.254: v22.76,36.6 23.47,35.89 25.67,35.89
  Bottom 0.305: 25.67,35.89 26.04,35.52 v26.04,34.92 | v29.21,16.19 28.72,15.7 IC1.43
SCK  (via drill 0.6)
  Top 0.406: v38.42,7.94 39.05,7.3 39.05,4.76 38.73,4.45 37.47,4.45 35.22,6.69 SD1.5
  Bottom 0.305: IC1.40 31.12,10.79 33.34,8.57 37.78,8.57 v38.42,7.94
SCL  (via drill 0.6)
  Top 0.305: v35.88,15.56 35.77,15.56 37.15,16.83 37.31,16.99 R14.2
  Bottom 0.305: v35.88,15.56 35.88,15.18 IC1.32 38.95,15.18 39.05,15.08 39.85,15.08 41.77,17.01 IC3.4
SD_ENABLE
  Bottom 0.305: IC1.41 30.32,10.8 33.66,7.46 IC6.3
SD_VCC  (via drill 0.6)
  Top 0.61: SD1.4 35.71,7.79 v38.1,5.4
  Bottom 0.61: C19.1 38.89,5.4 38.74,5.55 | C18.1 37.15,5.55 IC6.5 38.26,5.55 | v38.1,5.4 38.26,5.55 | C20.1 arc90 40.24,5.55 38.74,5.55 | 38.74,5.55 38.26,5.55
SDA  (via drill 0.6)
  Top 0.305: 39.37,16.03 v39.53,15.88
  Bottom 0.305: IC1.31 39.42,15.98 v39.53,15.88 39.53,17.3 40.8,18.57 41.59,18.57 41.8,18.36 43.24,18.36 | 43.24,18.36 IC3.6 | 43.24,18.36 43.24,19.58 R6.2
SWCLK  (via drill 0.6)
  Top 0.254: U$2.4 22.73,33.35 22.73,32.08
  Top 0.305: v30,15.24 29.05,15.24 28.26,16.03 28.26,17.94 29.21,18.89 29.21,29.53 28.26,30.48 23.5,30.48 22.73,31.24 22.73,32.08
  Bottom 0.305: IC1.42 29.52,14.76 v30,15.24
SWDIO  (via drill 0.6)
  Top 0.254: U$2.2 23.32,34.04 25.5,34.04
  Top 0.305: 25.5,34.04 30.16,29.37 30.16,18.57 v29.05,17.46
  Bottom 0.305: IC1.44 27.94,12.78 27.94,16.35 v29.05,17.46
UART0_RX
  Top 0.305: 44.77,21.34 U$4.P$9 44.7,22.93 42.39,25.24 42.39,26.35 43.81,27.78 X2.4
  Bottom 0.305: IC1.23 38.41,22.38 43.81,27.78 X2.4
UART0_TX
  Top 0.305: U$4.P$10 46.2,22.85 43.81,25.24 X2.2
  Bottom 0.305: IC1.24 39.04,21.58 43.18,25.72 X2.2
UART1_RX
  Bottom 0.305: IC1.37 33.52,11.09 33.97,10.64 36.51,10.64 36.83,10.95 37.47,10.95 38.42,10 46.46,10 46.46,10.08 46.55,10.18 47.24,10.87 47.24,14.73 47.27,14.78 47.24,15.1 47.24,16.92 47.26,17.27 47.24,17.29 47.24,23.9 46.35,24.78 X2.1
UART1_TX
  Bottom 0.305: IC1.36 34.32,11.56 34.45,11.43 37.78,11.43 38.73,10.48 46.23,10.5 46.78,11.05 46.78,14.89 46.8,14.92 46.78,15.07 46.78,16.94 46.79,17.1 46.78,17.11 46.78,19.38 46.18,19.98 46.18,24.32 45.24,25.25 45.24,26.18 46.35,27.3 X2.3
UART2_RX  (via drill 0.6)
  Top 0.305: R13.1 10.48,26.04 11.43,25.08 v19.68,25.08 19.11,25.08 R18.1
  Bottom 0.305: v19.68,25.08 19.68,26.04 20.64,26.99 21.59,26.99 21.91,26.67 31.11,26.67 31.92,25.87 IC1.17
UART2_TX  (via drill 0.6)
  Top 0.305: R7.2 12.48,26.04 v20.95,26.04
  Bottom 0.305: v20.95,26.04 30.8,26.04 31.11,25.72 IC1.16
VCC  (via drill 0.6)
  Top 0.305: U$2.1 23.31,35.88 26.83,35.88 26.99,35.72 30,35.72 35.24,30.48 35.24,30.16 | v41.75,14.61 41.75,18.89 v41.12,19.53 40.7,19.11 R14.1
  Top 0.406: C11.+ 32.7,18.17 v32.7,18.41 | C10.1 17.3,16.32 | C12.1 15.88,16.32
  Top 0.61: IC5.5 17.3,16.32 15.88,16.32 14.73,16.32 | 14.73,16.32 LED3.A | LED2.A 14.73,16.32 | v32.7,18.41 U$4.P$1 32.7,27.62 35.24,30.16 37.15,32.07 42.55,32.07 X2.6
  Bottom 0.254: IC3.10 45.19,16.99 45.71,16.99 45.94,16.78 45.94,15.24 45.6,14.95 45.55,14.93 45.21,14.68 44.75,14.68 44.52,14.45 44.24,14.45
  Bottom 0.305: IC3.14 44.24,14.45 44.24,14.29 43.74,14.29 | 43.74,14.29 41.75,14.29 v41.75,14.61 41.75,15.51 IC3.1 | v41.12,19.53 41.12,20.08 C9.1 41.19,19.6 42.86,21.27 43.44,21.27 R6.1 | C14.1 43.66,14.21 43.74,14.29
  Bottom 0.406: 20.32,17.58 IC1.5 IC1.6 33.02,18.38 IC1.28 38.93,18.38 39.69,18.41 C9.1 | 20.32,17.58 18.89,17.58 | 18.89,17.58 16.65,17.58 LED2.A | C7.1 20.32,17.58 | C8.1 18.89,17.58
  Bottom 0.61: LED1.A LED2.A | v32.7,18.41 32.7,18.38 33.02,18.38
VCC_5V  (via drill 0.6)
  Top 0.305: IC5.1 18.88,14.92 20.77,14.92 IC5.3
  Top 0.406: v17.78,13.02 18.88,13.02
  Top 0.61: IC5.1 18.88,13.02 18.88,10.97 21.55,8.3 | C15.1 30.8,7.62 v30.16,8.26
  Top 0.813: IC4.2 20.64,3.72 20.64,7.39 21.55,8.3 C2.+ C3.+ C4.+ 29.76,8.66 v30.16,8.26
  Bottom 0.406: IC2.3 9.53,13.02 v17.78,13.02
  Bottom 0.61: IC6.1 32.86,5.55 | 32.86,5.55 31.43,6.99 | 31.43,6.99 v30.16,8.26 | C17.1 32.35,6.02 32.86,5.55 | C16.1 31.43,6.99

### Text on the board
tNames: v0.2 | COIN / CELL
bNames: CC | BY-NC-SA | OBDlogger
Document: This work is licensed under a Creative Commons Attribution-NonCommercial-ShareAlike 4.0 International License.